# Altium schematic sheet Var10.SchDoc
size A4; SheetNumber: 13; SheetTotal: 13
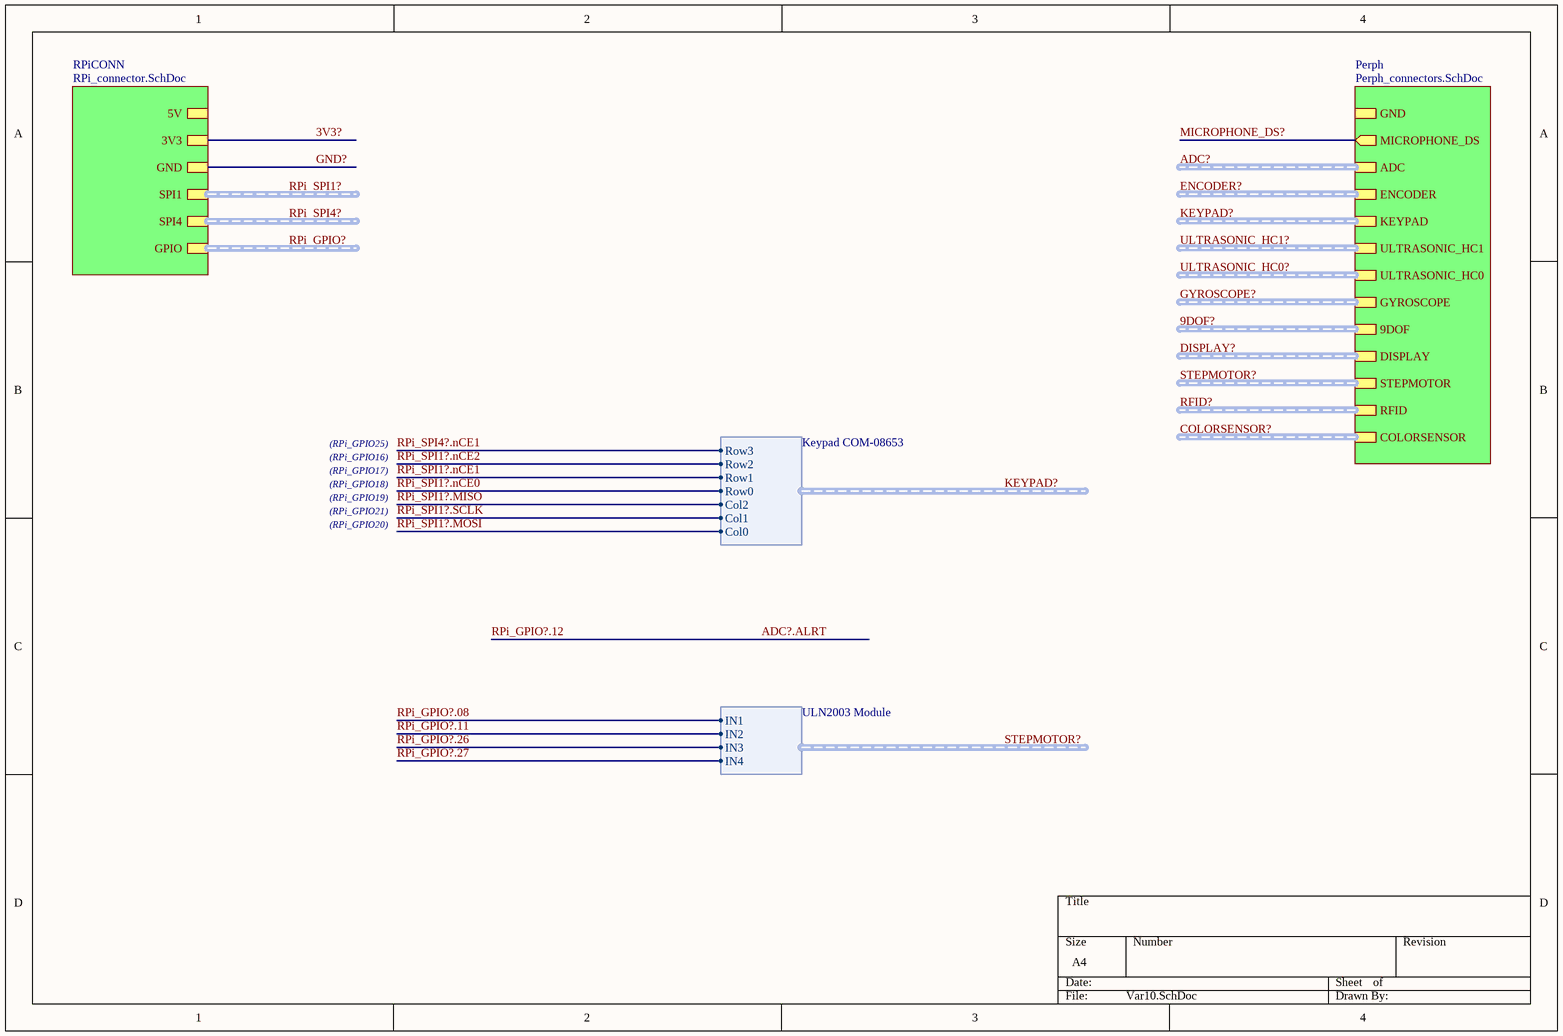
[diagram p0: Var10.SchDoc]

## Sub-sheets
Perph = Perph_connectors.SchDoc: MICROPHONE_DS (out), ADC (harness ADS1115 module), GYROSCOPE (harness GY-50 L3GD20 Gyro), ULTRASONIC_HC1 (harness HC-SR04), GND, KEYPAD (harness Keypad COM-08653), ULTRASONIC_HC0 (harness HC-SR04), DISPLAY (harness MSP3520), STEPMOTOR (harness ULN2003 Module), RFID (harness RC522), ENCODER (harness KY-040), COLORSENSOR (harness TCS34725), 9DOF (harness 9DOF)
RPiCONN = RPi_connector.SchDoc: 5V, 3V3, GND, SPI4 (harness SPI_2CS), SPI1 (harness SPI_3CS), GPIO (harness RPI_GPIO)

## Harnesses
Keypad COM-08653: Col0, Col1, Col2, Row0, Row1, Row2, Row3
ULN2003 Module: IN1, IN2, IN3, IN4

## Nets
3V3?: sheet RPiCONN/3V3
GND?: sheet RPiCONN/GND
MICROPHONE_DS?: sheet Perph/MICROPHONE_DS
RPi_GPIO?.08: sheet Perph/STEPMOTOR.IN1
RPi_GPIO?.11: sheet Perph/STEPMOTOR.IN2
RPi_GPIO?.26: sheet Perph/STEPMOTOR.IN3
RPi_GPIO?.27: sheet Perph/STEPMOTOR.IN4
RPi_SPI1?.MISO: sheet Perph/KEYPAD.Col2  [project net KEYPAD?.Col2]
RPi_SPI1?.MOSI: sheet Perph/KEYPAD.Col0  [project net KEYPAD?.Col0]
RPi_SPI1?.nCE0: sheet Perph/KEYPAD.Row0  [project net KEYPAD?.Row0]
RPi_SPI1?.nCE1: sheet Perph/KEYPAD.Row1  [project net KEYPAD?.Row1]
RPi_SPI1?.nCE2: sheet Perph/KEYPAD.Row2  [project net KEYPAD?.Row2]
RPi_SPI1?.SCLK: sheet Perph/KEYPAD.Col1  [project net KEYPAD?.Col1]
RPi_SPI4?.nCE1: sheet Perph/KEYPAD.Row3  [project net KEYPAD?.Row3]

## Buses and harness runs
harness 9DOF? = sheet Perph/9DOF
harness ADC? = sheet Perph/ADC
harness COLORSENSOR? = sheet Perph/COLORSENSOR
harness DISPLAY? = sheet Perph/DISPLAY
harness ENCODER? = sheet Perph/ENCODER
harness GYROSCOPE? = sheet Perph/GYROSCOPE
harness KEYPAD? = sheet Perph/KEYPAD
harness RFID? = sheet Perph/RFID
harness RPi_GPIO? = sheet RPiCONN/GPIO
harness RPi_SPI1? = sheet RPiCONN/SPI1
harness RPi_SPI4? = sheet RPiCONN/SPI4
harness STEPMOTOR? = sheet Perph/STEPMOTOR
harness ULTRASONIC_HC0? = sheet Perph/ULTRASONIC_HC0
harness ULTRASONIC_HC1? = sheet Perph/ULTRASONIC_HC1

## Notes on the sheet
- (RPi_GPIO25)
- (RPi_GPIO21)
- (RPi_GPIO16)
- (RPi_GPIO17)
- (RPi_GPIO18)
- (RPi_GPIO19)
- (RPi_GPIO20)